# Altium schematic sheet MCU.SchDoc
size A4
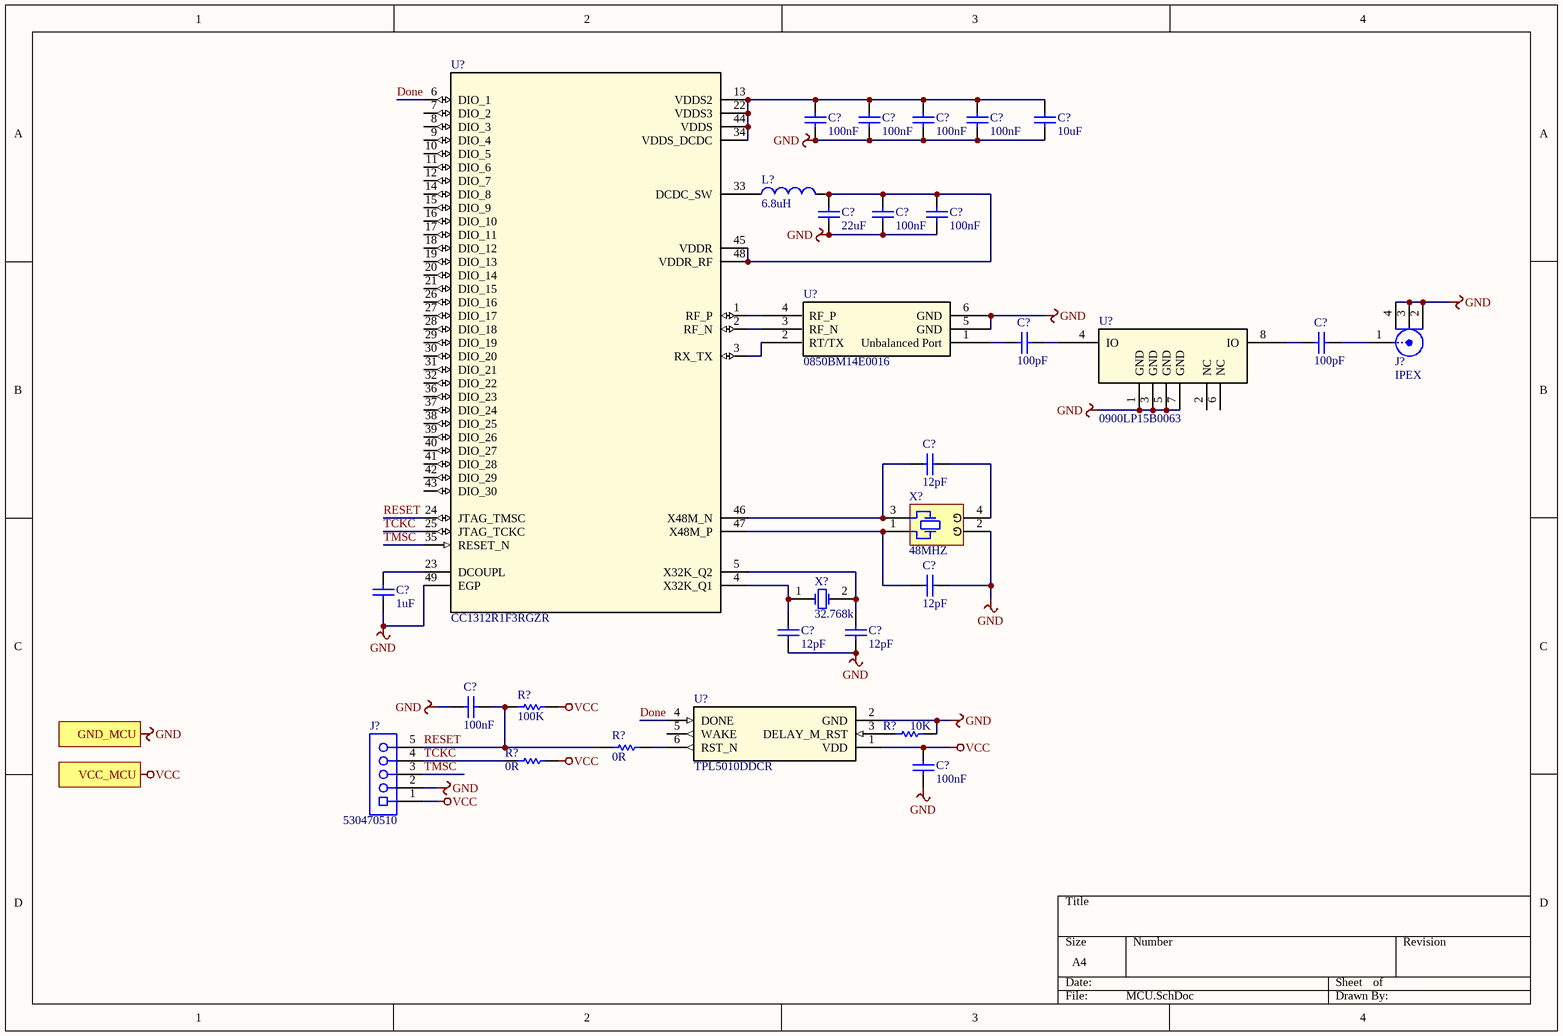
[diagram p0: MCU.SchDoc]

## Parts
(Parts that share a designator on the sheet are numbered #1, #2 ... from top to bottom, then left to right.)
C?#1  100nF  [S0603C]
C?#2  100nF  [S0603C]
C?#3  100nF  [S0603C]
C?#4  100nF  [S0603C]
C?#5  10uF  [S0805C]
C?#6  22uF  [S0805C]
C?#7  100nF  [S0603C]
C?#8  100nF  [S0603C]
C?#9  100pF  [S0402C]
C?#10  100pF  [S0402C]
C?#11  12pF  [S0603C]
C?#12  12pF  [S0603C]
C?#13  1uF  [S0603C]
C?#14  12pF  [S0603C]
C?#15  12pF  [S0603C]
C?#16  100nF  [S0603C]
C?#17  100nF  [S0603C]
J?#1  IPEX  [molex-73412]
J?#2  530470510  [1.25mm_p5]
L?  6.8uH  [S0805L]
R?#1  100K  [S0603R]
R?#2  10K  [S0603R]
R?#3  0R  [S0603R]
R?#4  0R  [S0603R]
U?#1  0850BM14E0016  [6P0603]
U?#2  CC1312R1F3RGZR  [RGZ0048A]
U?#3  0900LP15B0063  [8P0805]
U?#4  TPL5010DDCR  [DDC0006A_N]
X?#1  48MHZ  [SMD-2016]
X?#2  32.768k  [SMD-2012]

## Ports
GND_MCU, VCC_MCU

## Nets
GND: C?#1.1 C?#2.1 C?#3.1 C?#4.1 C?#5.1 C?#6.1 C?#7.1 C?#8.1 C?#12.1 C?#13.1 C?#14.1 C?#15.1 C?#16.2 C?#17.1 J?#1.2 J?#1.3 J?#1.4 J?#2.2 R?#2.1 U?#1.5(GND) U?#1.6(GND) U?#2.49(EGP) U?#3.1(GND) U?#3.3(GND) U?#3.5(GND) U?#3.7(GND) U?#4.2(GND) X?#1.2(GND) ; port GND_MCU
VCC: C?#17.2 J?#2.1 R?#1.2 R?#4.1 U?#4.1(VDD) ; port VCC_MCU
Done: U?#2.6(DIO_1) U?#4.4(DONE)
RESET: C?#16.1 J?#2.5 R?#1.1 R?#3.2 U?#2.24(JTAG_TMSC)
TCKC: J?#2.4 R?#4.2 U?#2.25(JTAG_TCKC)
TMSC: J?#2.3 U?#2.35(RESET_N)
NetC?#1_2: C?#1.2 C?#2.2 C?#3.2 C?#4.2 C?#5.2 U?#2.13(VDDS2) U?#2.22(VDDS3) U?#2.34(VDDS_DCDC) U?#2.44(VDDS)
NetC?#6_2: C?#6.2 C?#7.2 C?#8.2 L?.2 U?#2.45(VDDR) U?#2.48(VDDR_RF)
NetC?#9_1: C?#9.1 U?#1.1(Unbalanced_Port)
NetC?#9_2: C?#9.2 U?#3.4(IO)
NetC?#10_1: C?#10.1 U?#3.8(IO)
NetC?#10_2: C?#10.2 J?#1.1
NetC?#11_1: C?#11.1 X?#1.4(GND)
NetC?#11_2: C?#11.2 U?#2.46(X48M_N) X?#1.3
NetC?#12_2: C?#12.2 U?#2.47(X48M_P) X?#1.1
NetC?#13_2: C?#13.2 U?#2.23(DCOUPL)
NetC?#14_2: C?#14.2 U?#2.4(X32K_Q1) X?#2.1(OSC1)
NetC?#15_2: C?#15.2 U?#2.5(X32K_Q2) X?#2.2(OSC2)
NetL?_1: L?.1 U?#2.33(DCDC_SW)
NetR?#2_2: R?#2.2 U?#4.3(DELAY_M_RST)
NetR?#3_1: R?#3.1 U?#4.6(RST_N)
NetU?#1_2: U?#1.2(RT/TX) U?#2.3(RX_TX)
NetU?#1_3: U?#1.3(RF_N) U?#2.2(RF_N)
NetU?#1_4: U?#1.4(RF_P) U?#2.1(RF_P)

Not connected (* = marked no-connect by the designer): U?#2 7(DIO_2) 8(DIO_3) 9(DIO_4) 10(DIO_5) 11(DIO_6) 12(DIO_7) 14(DIO_8) 15(DIO_9) 16(DIO_10) 17(DIO_11) 18(DIO_12) 19(DIO_13) 20(DIO_14) 21(DIO_15) 26(DIO_16) 27(DIO_17) 28(DIO_18) 29(DIO_19) 30(DIO_20) 31(DIO_21) 32(DIO_22) 36(DIO_23) 37(DIO_24) 38(DIO_25) 39(DIO_26) 40(DIO_27) 41(DIO_28) 42(DIO_29) 43(DIO_30); U?#3 2(NC) 6(NC); U?#4 5(WAKE)

## Notes on the sheet
- (in symbol FA-128 48.000000MHz 10pF ±10ppm) G

## Library data of the parts
C?#1-C?#4 C?#7 C?#8 C?#16 C?#17 = 100nF/0603/50V: 精度 ±10% / 容值 100nF / 额定电压 50V / 温漂系数（介质材料) X7R; Manufacturer: FH(风华); A_Manufacturer: 元六; Code: 0603B104K500NT; A_Code: J CT41-0603-2R1-50V-104K; CompType: Capacitor; A_ComType: 二类电容; DistributorCode: C30926; Package: 0603
C?#5 = 10uF/0805/16V: 精度 ±10% / 容值 10uF / 额定电压 16V / 温漂系数（介质材料) X7R; Manufacturer: FH(风华); A_Manufacturer: 元六; Code: 0805B106K160NT; CompType: Capacitor; A_Code: J CT41-0805-2R2-16V-106M; A_ComType: 二类电容; Package: 0805; DistributorCode: C92341
C?#6 = 22uF/0805/16V: 精度 ±20% / 容值 22uF / 额定电压 16V / 温漂系数（介质材料) X5R; Manufacturer: FH(风华); A_Manufacturer: 元六; Code: 0805X226M160NT; A_Code: J CT41-0805-2R2-16V-226M; CompType: Capacitor; A_ComType: 二类电容; DistributorCode: C129302; Package: 0805
C?#9 C?#10 = 100pF/0402/50V: 精度 ±5% / 容值 100pF / 额定电压 50V / 温漂系数（介质材料) C0G; Manufacturer: FH(风华); A_Manufacturer: 元六; Code: 0402CG101J500NT; A_Code: J CC41-0402-CG-50V-101J; CompType: Capacitor; A_ComType: 一类电容; DistributorCode: C1546; Package: 0402
C?#11 C?#12 C?#14 C?#15 = 12pF/0603/50V: 精度 ±5% / 容值 12pF / 额定电压 50V / 温漂系数（介质材料) C0G; Manufacturer: FH(风华); A_Manufacturer: 元六; Code: 0603CG120J500NT; A_Code: J CC41-0603-CG-50V-120J; CompType: Capacitor; A_ComType: 一类电容; DistributorCode: C1642; Package: 0603
C?#13 = 1uF/0603/50V: 精度 ±10% / 容值 1uF / 额定电压 50V / 温漂系数（介质材料) X7R; Manufacturer: FH(风华); A_Manufacturer: 元六; Code: 0603B105K500NT; A_Code: J CT41-0603-2R1-50V-105M; CompType: Capacitor; A_ComType: 二类电容; DistributorCode: C90540; Package: 0603
J?#1 = 73412-0110: RF同轴连接器（天线座）; Manufacturer: MOLEX; Code: 734120110; CompType: IPEX插座; DistributorCode: C434806; Package: SMD
J?#2 = Molex-530470510: MX1.25 直插 镀锡 5P 针座; Manufacturer: MOLEX; CompType: 连接器; Code: 530470510; DistributorCode: C471412; Package: 1.25mm 5p; A_Code: -; A_ComType: -; A_Manufacturer: -
L? = 6.8uH/0805: 精度 ±10% / 电感值 6.8uH / 直流电阻（内阻） 250mΩ / 额定电流 250mA; Manufacturer: FH(风华); A_Manufacturer: 振华富; Code: CMP201209XD6R8KT; A_Code: PI2012F6R8; CompType: Inductor; DistributorCode: C139247; Package: 0805; A_ComType: -
R?#1 = 100K/0603: 精度 ±1% / 阻值 100kΩ / 温度系数 ±100ppm/℃ / 功率 0.1W; Manufacturer: FH(风华); A_Manufacturer: 718; Code: RS-03K1003FT; A_Code: J-RM1608(0603)-K-B-100K-F; CompType: Resistor; A_ComType: RM型片式膜固定电阻器; DistributorCode: C115320; Package: 0603
R?#2 = 10K/0603: 精度 ±1% / 温度系数 ±100ppm/℃ / 阻值 10kΩ / 功率 0.1W; Manufacturer: FH(风华); A_Manufacturer: 718; Code: RS-03K1002FT; A_Code: J-RM1608(0603)-K-B-10K-F; CompType: Resistor; A_ComType: RM型片式膜固定电阻器; DistributorCode: C115324; Package: 0603
R?#3 R?#4 = 0R/0603: 精度 ±1% / 阻值 0Ω / 功率 0.1W; Manufacturer: FH(风华); A_Manufacturer: 718; Code: RS-03000FT; A_Code: J-RM1608(0603)-K-B-0R-F; CompType: Resistor; A_ComType: RM型片式膜固定电阻器; DistributorCode: C136582; Package: 0603
U?#1 = 0850BM14E0016: 770 - 860 860 - 928MHz / -40°C to +85°C / Pmax 2W; Manufacturer: Johanson Technology; CompType: Balun; Code: 0850BM14E0016; DistributorCode: -; Package: 6P0603; A_Code: -; A_ComType: -; A_Manufacturer: -
U?#2 = CC1312R1F3RGZR: RF-MCU; Manufacturer: TI(德州仪器); CompType: MCU; DistributorCode: C543014; Package: VQFN-48; Code: CC1312R1F3RGZR; A_Code: -; A_ComType: -; A_Manufacturer: -
U?#3 = 0900LP15B0063: 863 - 960MHz / -40 to +85°C / 3Fo Attenuation (2589-2784MHz) 50dB / 2Fo Attenuation (1726-1856MHz) 59dB /; Manufacturer: Johanson Technology; CompType: 低通; Code: 0900LP15B0063; DistributorCode: *; Package: 8P0805
U?#4 = TPL5010DDCR: 看门狗; Manufacturer: TI(德州仪器); Code: TPL5010DDCR; DistributorCode: C473912; Package: SOT23-Thin-6; CompType: 看门狗; A_Code: -; A_ComType: -; A_Manufacturer: -
X?#1 = FA-128 48.000000MHz 10pF ±10ppm: Q22FA12800150 / 等效串联电阻（ESR） 60Ω / 晶振类型 无源贴片晶振 / 主频 48MHz / 频率公差 ±10ppm / 负载电容值 10pF / 工作温度 -40℃ ~ +85℃; Manufacturer: EPSON(爱普生); CompType: 晶振; Code: FA-128 48.000000MHz 10pF ±10ppm; DistributorCode: C255900; Package: SMD-2016; A_Code: -; A_ComType: -; A_Manufacturer: -
X?#2 = X1A000061002100: X1A000061002100 / 等效串联电阻（ESR） 90kΩ / 晶振类型 无源贴片晶振 / 主频 32.768KHz / 频率公差 ±20ppm / 负载电容值 6pF / 工作温度 -40℃ ~ +85℃; Manufacturer: EPSON(爱普生); Code: FC-12M 32.768kHz 6pF ±20ppm; CompType: 晶振; DistributorCode: C255767; Package: SMD-2012; A_Code: -; A_ComType: -; A_Manufacturer: -